# EAGLE design KarateLight (EAGLE 6.3)

## Sheet 1 of 2
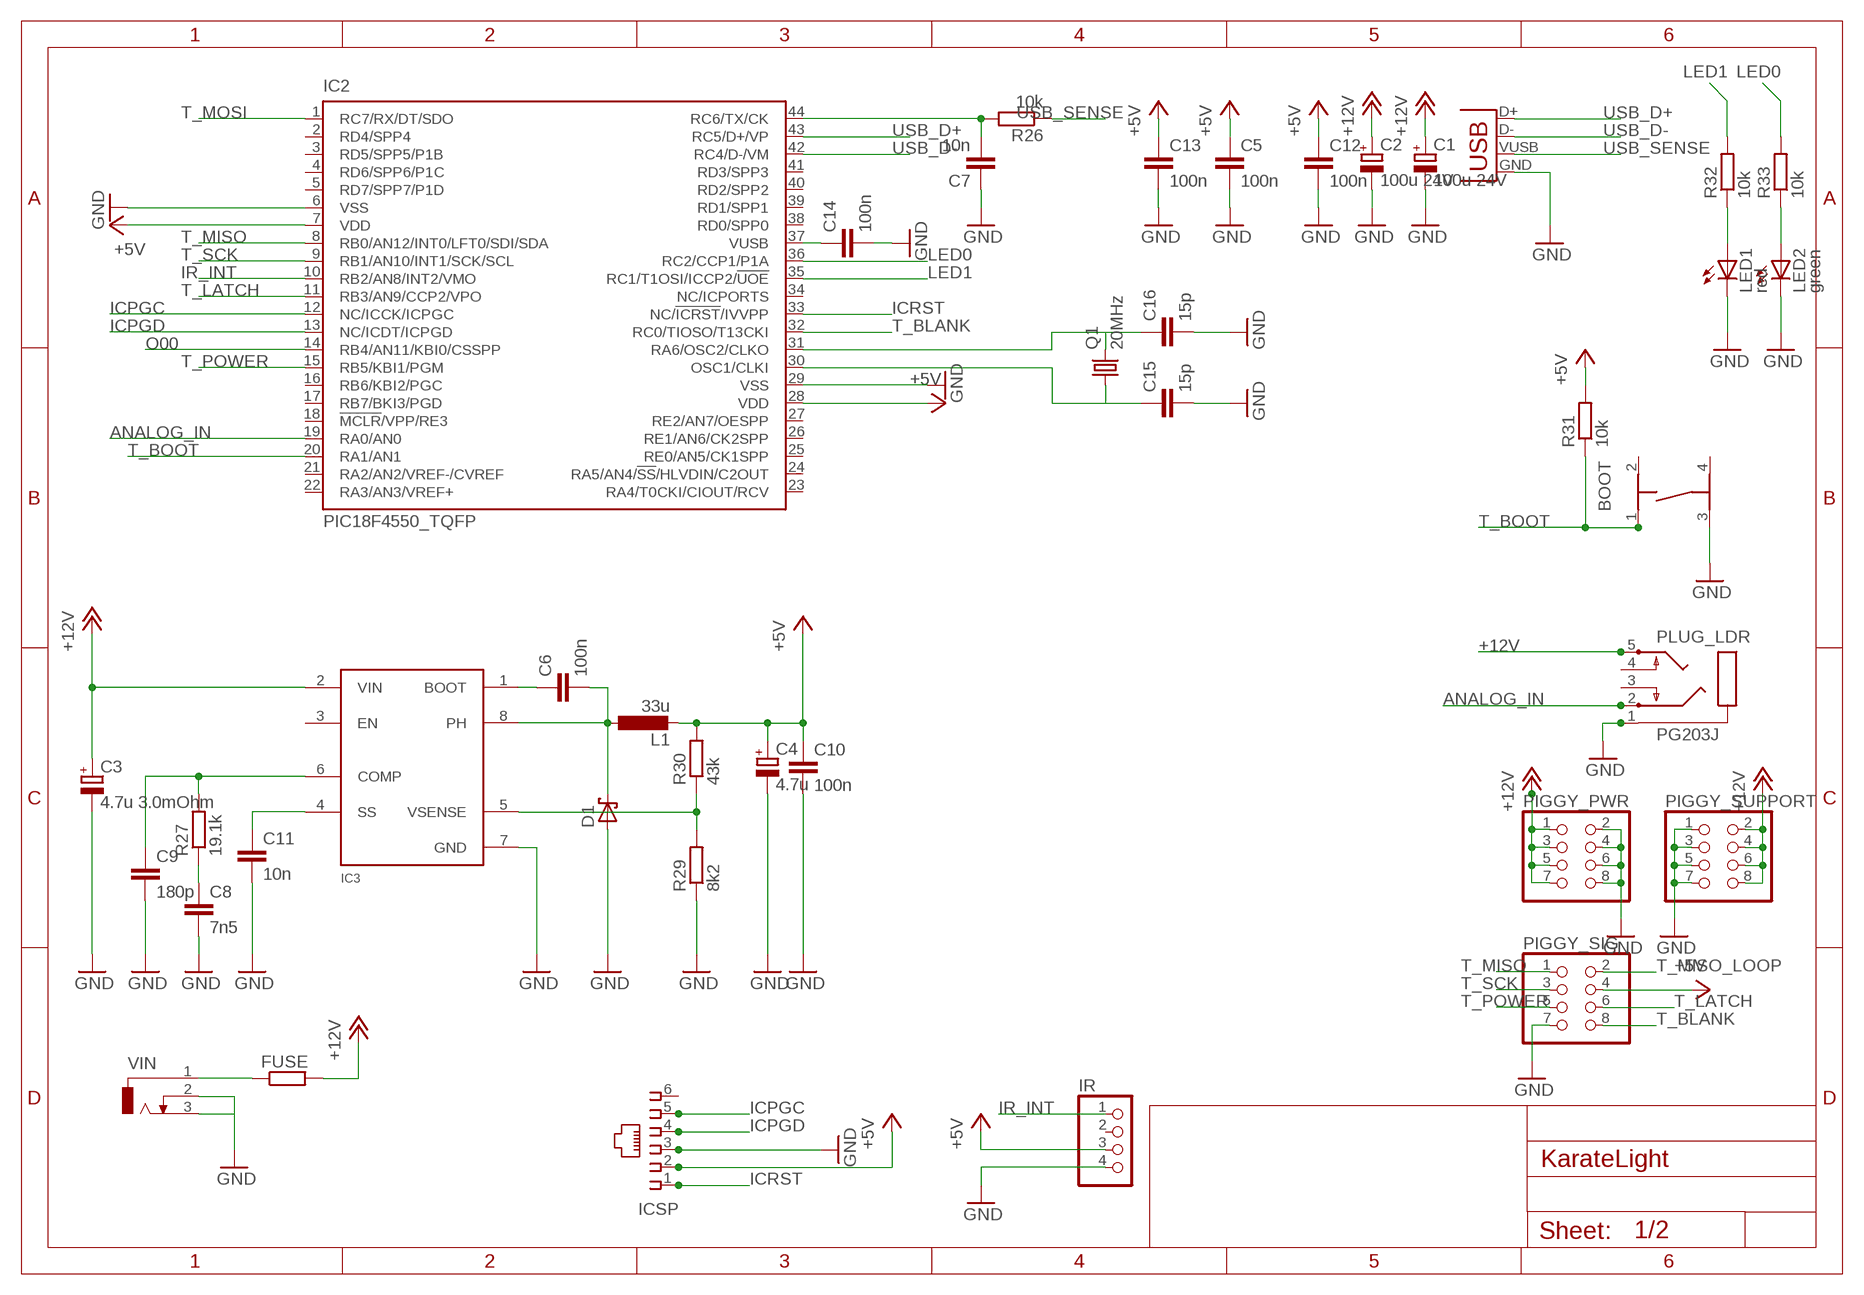
[diagram p0: schematic, sheet 1]

### Parts
BOOT  TASTER-9314_SMD  [TASTER-9314_SMD]
C1  100u 24V  CPOL-EU153CLV-0605  [153CLV-0605]
C2  100u 24V  CPOL-EU153CLV-0605  [153CLV-0605]
C3  4.7u 3.0mOhm  CPOL-EU153CLV-0405  [153CLV-0405]
C4  4.7u  CPOL-EU153CLV-0405  [153CLV-0405]
C5  100n  C-EUC0805K  [C0805K]
C6  100n  C-EUC0603  [C0603]
C7  10n  C-EUC0603  [C0603]
C8  7n5  C-EUC0603  [C0603]
C9  180p  C-EUC0603  [C0603]
C10  100n  C-EUC0603  [C0603]
C11  10n  C-EUC0603  [C0603]
C12  100n  C-EUC0603  [C0603]
C13  100n  C-EUC0805K  [C0805K]
C14  100n  C-EUC0805K  [C0805K]
C15  15p  C-EUC0603  [C0603]
C16  15p  C-EUC0603  [C0603]
D1  SCHOTTKY-DIODESMD  [SMB]
FUSE  R-EU_R4527  [R4527]
IC2  PIC18F4550_TQFP  [TQFP44]
IC3  TPS54232  [SO-08]
ICSP  520250-3  [520250-3]
IR  PINHD-1X4  [1X04]
L1  33u  L-EUPIS2816  [PIS2816]
LED1  red  LEDCHIP-LED0805  [CHIP-LED0805]
LED2  green  LEDCHIP-LED0805  [CHIP-LED0805]
PIGGY_PWR  PINHD-2X4  [2X04]
PIGGY_SIG  PINHD-2X4  [2X04]
PIGGY_SUPPORT  PINHD-2X4  [2X04]
PLUG_LDR  PG203J  [PG203J]
PLUG_USB  USB-B-S  [USB-B-SMT]
Q1  20MHz  CRYSTALHC49UP  [HC49UP]
R26  10k  R-EU_R0603  [R0603]
R27  19.1k  R-EU_R0603  [R0603]
R29  8k2  R-EU_R0603  [R0603]
R30  43k  R-EU_R0603  [R0603]
R31  10k  R-EU_R0603  [R0603]
R32  10k  R-EU_R0603  [R0603]
R33  10k  R-EU_R0603  [R0603]
VIN  DCJ0303  [DCJ0303]

### Nets
+5V: C4.+ C5.1 C10.1 C12.1 C13.1 IC2.7(VDD) IC2.28(VDD) ICSP.2 IR.3 L1.2 PIGGY_SIG.4 R30.2 R31.2 ; also sheet 2
+12V: C1.+ C2.+ C3.+ FUSE.2 IC3.2(VIN) PIGGY_PWR.1 PIGGY_PWR.3 PIGGY_PWR.5 PIGGY_PWR.7 PIGGY_SUPPORT.2 PIGGY_SUPPORT.4 PIGGY_SUPPORT.6 PIGGY_SUPPORT.8 PLUG_LDR.5 ; also sheet 2
ANALOG_IN: IC2.19(RA0/AN0) PLUG_LDR.2
BOOST: C6.2 D1.C IC3.8(PH) L1.1
GND: BOOT.3 C1.- C2.- C3.- C4.- C5.2 C7.1 C8.2 C9.2 C10.2 C11.2 C12.2 C13.2 C14.2 C15.2 C16.2 D1.A IC2.6(VSS) IC2.29(VSS) IC3.7(GND) ICSP.3 IR.4 LED1.C LED2.C PIGGY_PWR.2 PIGGY_PWR.4 PIGGY_PWR.6 PIGGY_PWR.8 PIGGY_SIG.7 PIGGY_SUPPORT.1 PIGGY_SUPPORT.3 PIGGY_SUPPORT.5 PIGGY_SUPPORT.7 PLUG_LDR.1 PLUG_USB.GND R29.1 VIN.2 VIN.3 ; also sheet 2
ICPGC: IC2.12(NC/ICCK/ICPGC) ICSP.5
ICPGD: IC2.13(NC/ICDT/ICPGD) ICSP.4
ICRST: IC2.33(NC/!ICRST!/IVVPP) ICSP.1
IR_INT: IC2.10(RB2/AN8/INT2/VMO) IR.1
LED0: IC2.36(RC2/CCP1/P1A) R33.2
LED1: IC2.35(RC1/T1OSI/ICCP2/!UOE) R32.2
N$2: C14.1 IC2.37(VUSB)
N$3: C15.1 IC2.30(OSC1/CLKI) Q1.1
N$4: C16.1 IC2.31(RA6/OSC2/CLKO) Q1.2
N$5: C8.1 R27.1
N$9: C7.2 IC2.44(RC6/TX/CK) R26.2
N$10: LED1.A R32.1
N$14: C9.1 IC3.6(COMP) R27.2
N$18: LED2.A R33.1
N$37: C11.1 IC3.4(SS)
N$38: IC3.5(VSENSE) R29.2 R30.1
N$39: C6.1 IC3.1(BOOT)
O00: IC2.14(RB4/AN11/KBI0/CSSPP) ; also sheet 2
T_BLANK: IC2.32(RC0/TIOSO/T13CKI) PIGGY_SIG.8 ; also sheet 2
T_BOOT: BOOT.1 IC2.20(RA1/AN1) R31.1
T_LATCH: IC2.11(RB3/AN9/CCP2/VPO) PIGGY_SIG.6 ; also sheet 2
T_MISO: IC2.8(RB0/AN12/INT0/LFT0/SDI/SDA) PIGGY_SIG.1
T_MISO_LOOP: PIGGY_SIG.2 ; also sheet 2
T_MOSI: IC2.1(RC7/RX/DT/SDO) ; also sheet 2
T_POWER: IC2.15(RB5/KBI1/PGM) PIGGY_SIG.5 ; also sheet 2
T_SCK: IC2.9(RB1/AN10/INT1/SCK/SCL) PIGGY_SIG.3 ; also sheet 2
USB_D+: IC2.43(RC5/D+/VP) PLUG_USB.D+
USB_D-: IC2.42(RC4/D-/VM) PLUG_USB.D-
USB_SENSE: PLUG_USB.VUSB(VBUS) R26.1
VIN: FUSE.1 VIN.1
Unconnected: BOOT.2 BOOT.4 IC2.2(RD4/SPP4) IC2.3(RD5/SPP5/P1B) IC2.4(RD6/SPP6/P1C) IC2.5(RD7/SPP7/P1D) IC2.16(RB6/KBI2/PGC) IC2.17(RB7/BKI3/PGD) IC2.18(!MCLR!/VPP/RE3) IC2.21(RA2/AN2/VREF-/CVREF) IC2.22(RA3/AN3/VREF+) IC2.23(RA4/T0CKI/CIOUT/RCV) IC2.24(RA5/AN4/!SS!/HLVDIN/C2OUT) IC2.25(RE0/AN5/CK1SPP) IC2.26(RE1/AN6/CK2SPP) IC2.27(RE2/AN7/OESPP) IC2.34(NC/ICPORTS) IC2.38(RD0/SPP0) IC2.39(RD1/SPP1) IC2.40(RD2/SPP2) IC2.41(RD3/SPP3) IC3.3(EN) ICSP.6 IR.2 PLUG_LDR.3 PLUG_LDR.4

## Sheet 2 of 2
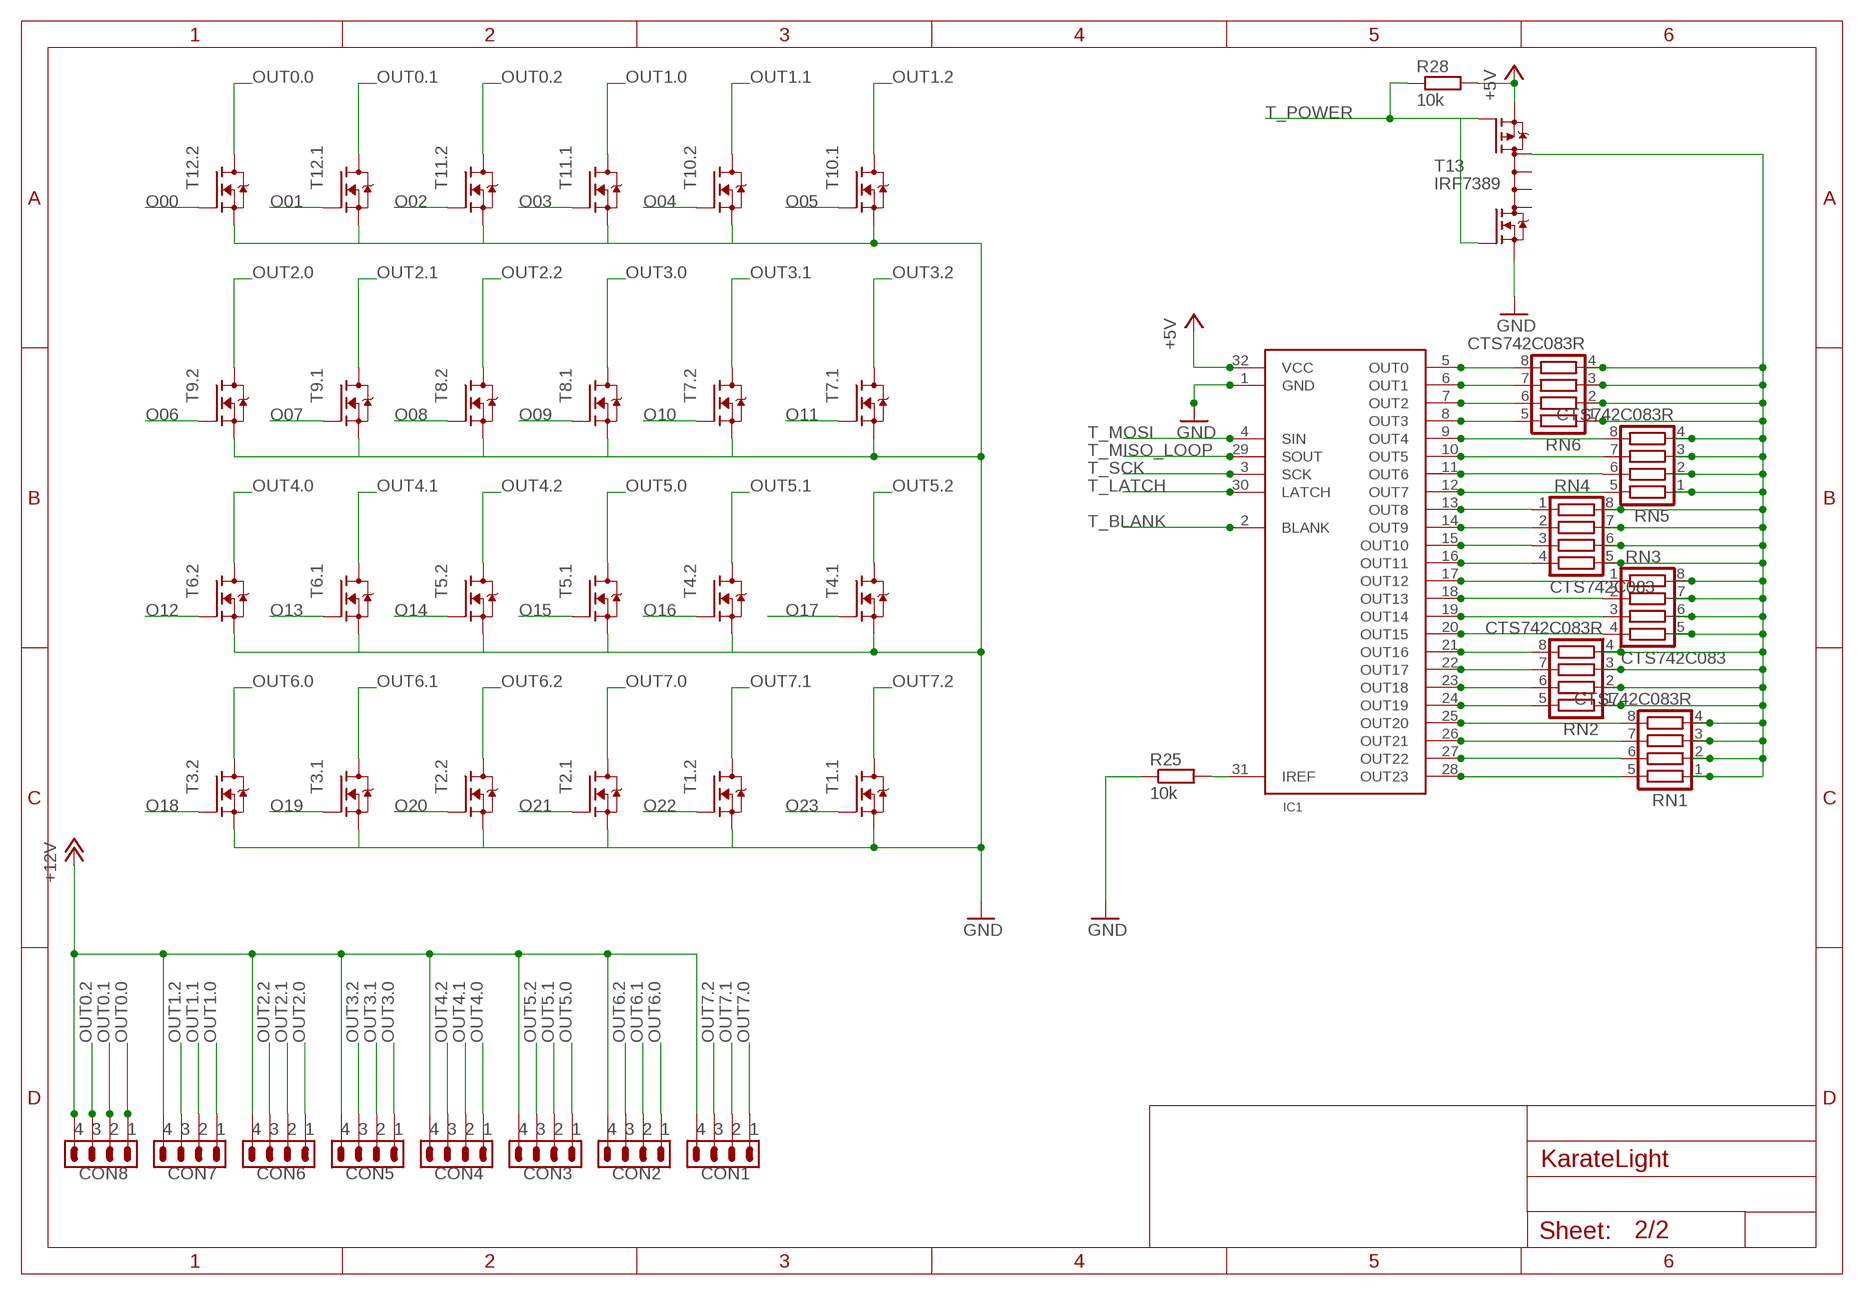
[diagram p1: schematic, sheet 2]

### Parts
CON1  PINHEAD_4W  [MA04-1]
CON2  PINHEAD_4W  [MA04-1]
CON3  PINHEAD_4W  [MA04-1]
CON4  PINHEAD_4W  [MA04-1]
CON5  PINHEAD_4W  [MA04-1]
CON6  PINHEAD_4W  [MA04-1]
CON7  PINHEAD_4W  [MA04-1]
CON8  PINHEAD_4W  [MA04-1]
IC1  TLC5947  [TSSOP32]
R25  10k  R-EU_R0603  [R0603]
R28  10k  R-EU_R0603  [R0603]
RN1  CTS742C083R  [CTS742C083]
RN2  CTS742C083R  [CTS742C083]
RN3  CTS742C083  [CTS742C083]
RN4  CTS742C083  [CTS742C083]
RN5  CTS742C083R  [CTS742C083]
RN6  CTS742C083R  [CTS742C083]
T1  IRF7103  [SO08-IRF]
T2  IRF7103  [SO08-IRF]
T3  IRF7103  [SO08-IRF]
T4  IRF7103  [SO08-IRF]
T5  IRF7103  [SO08-IRF]
T6  IRF7103  [SO08-IRF]
T7  IRF7103  [SO08-IRF]
T8  IRF7103  [SO08-IRF]
T9  IRF7103  [SO08-IRF]
T10  IRF7103  [SO08-IRF]
T11  IRF7103  [SO08-IRF]
T12  IRF7103  [SO08-IRF]
T13  IRF7389  [SO08-IRF]

### Nets
+5V: IC1.32(VCC) R28.2 T13.3(P-S) ; also sheet 1
+12V: CON1.4 CON2.4 CON3.4 CON4.4 CON5.4 CON6.4 CON7.4 CON8.4 ; also sheet 1
FET-ONOFF: RN1.1 RN1.2 RN1.3 RN1.4 RN2.1 RN2.2 RN2.3 RN2.4 RN3.5 RN3.6 RN3.7 RN3.8 RN4.5 RN4.6 RN4.7 RN4.8 RN5.1 RN5.2 RN5.3 RN5.4 RN6.1 RN6.2 RN6.3 RN6.4 T13.5(D)
GND: IC1.1(GND) R25.1 T1.1(.1:S) T1.3(.2:S) T2.1(.1:S) T2.3(.2:S) T3.1(.1:S) T3.3(.2:S) T4.1(.1:S) T4.3(.2:S) T5.1(.1:S) T5.3(.2:S) T6.1(.1:S) T6.3(.2:S) T7.1(.1:S) T7.3(.2:S) T8.1(.1:S) T8.3(.2:S) T9.1(.1:S) T9.3(.2:S) T10.1(.1:S) T10.3(.2:S) T11.1(.1:S) T11.3(.2:S) T12.1(.1:S) T12.3(.2:S) T13.1(N-S) ; also sheet 1
N$1: IC1.31(IREF) R25.2
O00: IC1.5(OUT0) RN6.8 T12.4(.2:G) ; also sheet 1
O01: IC1.6(OUT1) RN6.7 T12.2(.1:G)
O02: IC1.7(OUT2) RN6.6 T11.4(.2:G)
O03: IC1.8(OUT3) RN6.5 T11.2(.1:G)
O04: IC1.9(OUT4) RN5.8 T10.4(.2:G)
O05: IC1.10(OUT5) RN5.7 T10.2(.1:G)
O06: IC1.11(OUT6) RN5.6 T9.4(.2:G)
O07: IC1.12(OUT7) RN5.5 T9.2(.1:G)
O08: IC1.13(OUT8) RN4.1 T8.4(.2:G)
O09: IC1.14(OUT9) RN4.2 T8.2(.1:G)
O10: IC1.15(OUT10) RN4.3 T7.4(.2:G)
O11: IC1.16(OUT11) RN4.4 T7.2(.1:G)
O12: IC1.17(OUT12) RN3.1 T6.4(.2:G)
O13: IC1.18(OUT13) RN3.2 T6.2(.1:G)
O14: IC1.19(OUT14) RN3.3 T5.4(.2:G)
O15: IC1.20(OUT15) RN3.4 T5.2(.1:G)
O16: IC1.21(OUT16) RN2.8 T4.4(.2:G)
O17: IC1.22(OUT17) RN2.7 T4.2(.1:G)
O18: IC1.23(OUT18) RN2.6 T3.4(.2:G)
O19: IC1.24(OUT19) RN2.5 T3.2(.1:G)
O20: IC1.25(OUT20) RN1.8 T2.4(.2:G)
O21: IC1.26(OUT21) RN1.7 T2.2(.1:G)
O22: IC1.27(OUT22) RN1.6 T1.4(.2:G)
O23: IC1.28(OUT23) RN1.5 T1.2(.1:G)
OUT0.0: CON8.1 T12.6(.2:D)
OUT0.1: CON8.2 T12.8(.1:D)
OUT0.2: CON8.3 T11.6(.2:D)
OUT1.0: CON7.1 T11.8(.1:D)
OUT1.1: CON7.2 T10.6(.2:D)
OUT1.2: CON7.3 T10.8(.1:D)
OUT2.0: CON6.1 T9.6(.2:D)
OUT2.1: CON6.2 T9.8(.1:D)
OUT2.2: CON6.3 T8.6(.2:D)
OUT3.0: CON5.1 T8.8(.1:D)
OUT3.1: CON5.2 T7.6(.2:D)
OUT3.2: CON5.3 T7.8(.1:D)
OUT4.0: CON4.1 T6.6(.2:D)
OUT4.1: CON4.2 T6.8(.1:D)
OUT4.2: CON4.3 T5.6(.2:D)
OUT5.0: CON3.1 T5.8(.1:D)
OUT5.1: CON3.2 T4.6(.2:D)
OUT5.2: CON3.3 T4.8(.1:D)
OUT6.0: CON2.1 T3.6(.2:D)
OUT6.1: CON2.2 T3.8(.1:D)
OUT6.2: CON2.3 T2.6(.2:D)
OUT7.0: CON1.1 T2.8(.1:D)
OUT7.1: CON1.2 T1.6(.2:D)
OUT7.2: CON1.3 T1.8(.1:D)
T_BLANK: IC1.2(BLANK) ; also sheet 1
T_LATCH: IC1.30(LATCH) ; also sheet 1
T_MISO_LOOP: IC1.29(SOUT) ; also sheet 1
T_MOSI: IC1.4(SIN) ; also sheet 1
T_POWER: R28.1 T13.2(N-G) T13.4(P-G) ; also sheet 1
T_SCK: IC1.3(SCK) ; also sheet 1
Unconnected: T13.6(D) T13.7(D) T13.8(D)

## Library data of the parts
BOOT = Ergaenzung:TASTER-9314_SMD
C1-C4 = rcl:CPOL-EU: POLARIZED CAPACITOR, European symbol
C5-C16 = rcl:C-EU: CAPACITOR, European symbol
CON1-CON8 = pinheader:PINHEAD_4W
D1 = diode:SCHOTTKY-DIODE: Schottky Diode
FUSE R25-R33 = rcl:R-EU_: RESISTOR, European symbol
IC1 = TLC5947:TLC5947: 24CH PWM LED Driver
IC2 = microchip:PIC18F4*_TQFP: USB Microcontrollers with nanoWatt Technology High-Performance, Enhanced Flash, 28/40/44-Pin, Source: http://ww1.microchip.com/downloads/en/devicedoc/39632c.pdf
IC3 = tps54232:TPS54232: TPS54232 2-A, 28-V, 1-MHz, Step-Down DC-DC Converter With Eco-Mode
ICSP = con-amp:520250-3: AMP connector
IR = pinhead:PINHD-1X4: PIN HEADER
L1 = rcl:L-EU: INDUCTOR, European symbol
LED1 LED2 = led:LED: LED OSRAM: - CHIPLED LG R971, LG N971, LY N971, LG Q971, LY Q971, LO R971, LY R971 LH N974, LH R974 LS Q976, LO Q976, LY Q976 LO Q996 - Hyper CHIPLED LW Q18S LB Q993, LB Q99A, LB R99A - SideLED LS A670, LO A670, LY A670, LG A670, LP A670 LB A673, LV A673, LT A673, LW A673 LH A674 LY A675 LS A676, LA A676, LO A676, LY A676, LW A676 LS A679, LY A679, LG A679 - Hyper Micro SIDELED® LS Y876, LA Y876, LO Y876, LY Y876 LT Y87S - SmartLED LW L88C, LW L88S LB L89C, LB L89S, LG L890 LS L89K, LO L89K, LY L89K LS L896, LA L896, LO L896, LY L896 - TOPLED LS T670, LO T670, LY T670, LG T670, LP T670 LSG T670, LSP T670, LSY T670, LOP T670, LYG T670 LG T671, LOG T671, LSG T671 LB T673, LV T673, LT T673, LW T673 LH T674 LS T676, LA T676, LO T676, LY T676, LB T676, LH T676, LSB T676, LW T676 LB T67C, LV T67C, LT T67C, LS T67K, LO T67K, LY T67K, LW E67C LS E67B, LA E67B, LO E67B, LY E67B, LB E67C, LV E67C, LT E67C LW T67C LS T679, LY T679, LG T679 LS T770, LO T770, LY T770, LG T770, LP T770 LB T773, LV T773, LT T773, LW T773 LH T774 LS E675, LA E675, LY E675, LS T675 LS T776, LA T776, LO T776, LY T776, LB T776 LHGB T686 LT T68C, LB T68C - Hyper Mini TOPLED® LB M676 - Mini TOPLED Santana® LG M470 LS M47K, LO M47K, LY M47K Source: http://www.osram.convergy.de LUXEON: - LUMILED® LXK2-PW12-R00, LXK2-PW12-S00, LXK2-PW14-U00, LXK2-PW14-V00 LXK2-PM12-R00, LXK2-PM12-S00, LXK2-PM14-U00 LXK2-PE12-Q00, LXK2-PE12-R00, LXK2-PE12-S00, LXK2-PE14-T00, LXK2-PE14-U00 LXK2-PB12-K00, LXK2-PB12-L00, LXK2-PB12-M00, LXK2-PB14-N00, LXK2-PB14-P00, LXK2-PB14-Q00 LXK2-PR12-L00, LXK2-PR12-M00, LXK2-PR14-Q00, LXK2-PR14-R00 LXK2-PD12-Q00, LXK2-PD12-R00, LXK2-PD12-S00 LXK2-PH12-R00, LXK2-PH12-S00 LXK2-PL12-P00, LXK2-PL12-Q00, LXK2-PL12-R00 Source: www.luxeon.com KINGBRIGHT: KA-3528ASYC Source: www.kingbright.com
PIGGY_PWR PIGGY_SIG PIGGY_SUPPORT = pinhead:PINHD-2X4: PIN HEADER
PLUG_LDR = 3.5mm_klinke:PG203J: MIC/HEADPHONE JACK KS-S stereo microphone/headphone jack PG203JN (Schukat); OC_FARNELL: unknown; OC_NEWARK: unknown
PLUG_USB = con-usb:USB: USB Connectors
Q1 = crystal:CRYSTAL: CRYSTAL
RN1 RN2 RN5 RN6 = res-network:CTS742C083: Chip Resistor Array 4 Single Resistor Source: http://www.ctscorp.com/components/Datasheets/CTSChipArrayDs.pdf
RN3 RN4 = res-network:CTS742C083: Chip Resistor Array 4 Single Resistor Source: http://www.ctscorp.com/components/Datasheets/CTSChipArrayDs.pdf; OC_FARNELL: unknown; OC_NEWARK: unknown
T1-T12 = IRF7103:IRF7103: Dual HexFET Power Mosfet http://www.irf.com/product-info/datasheets/data/irf7103.pdf
T13 = transistor-fet:IRF7389: Complimentary Half Bridge HEXFET Power MOSFET Source: http://www.irf.com/product-info/datasheets/data/irf7389.pdf
VIN = con-jack:DCJ0303: DC POWER JACK Source: DCJ0303.pdf

## Board
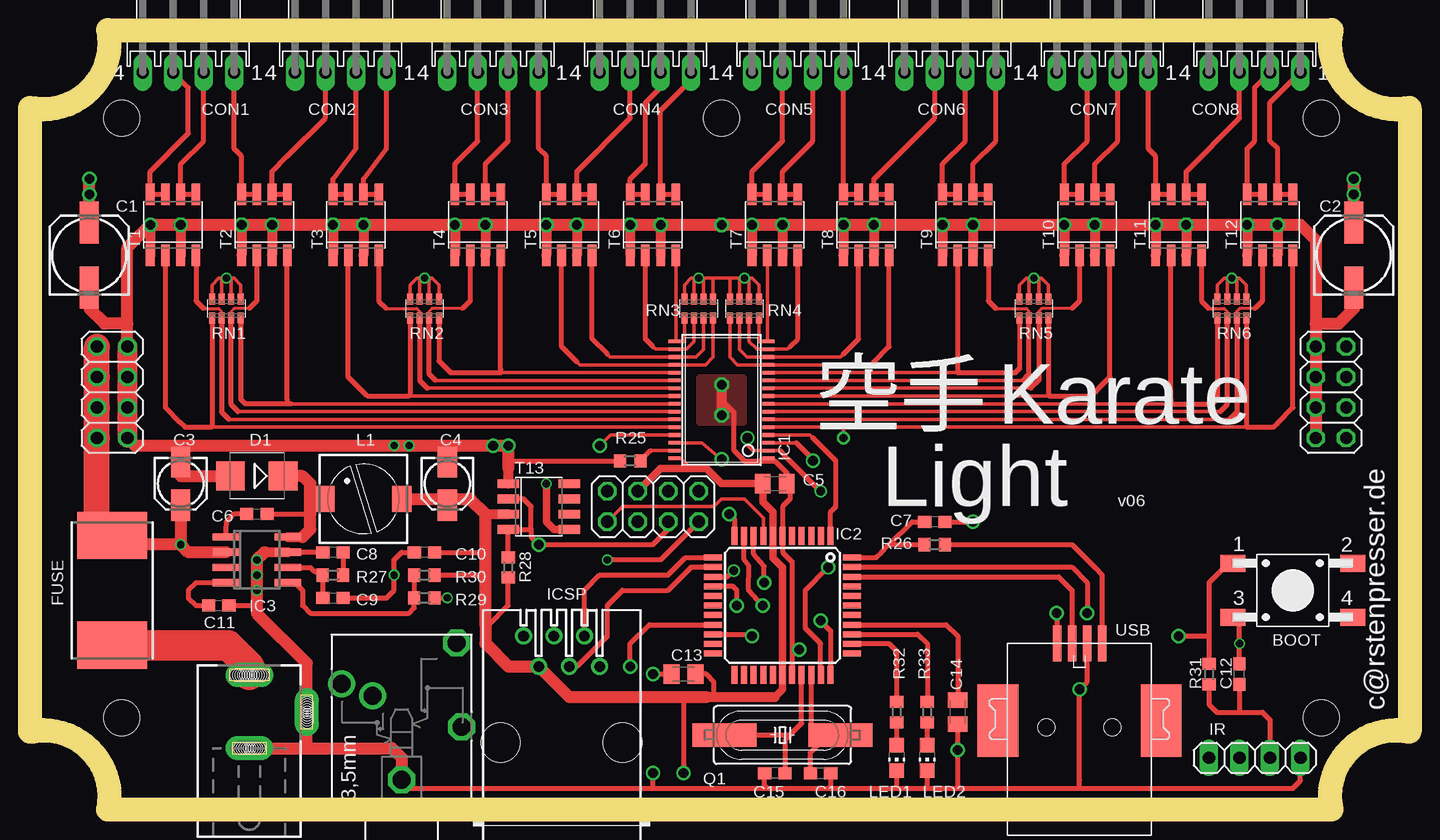
[diagram p2: board, top side]
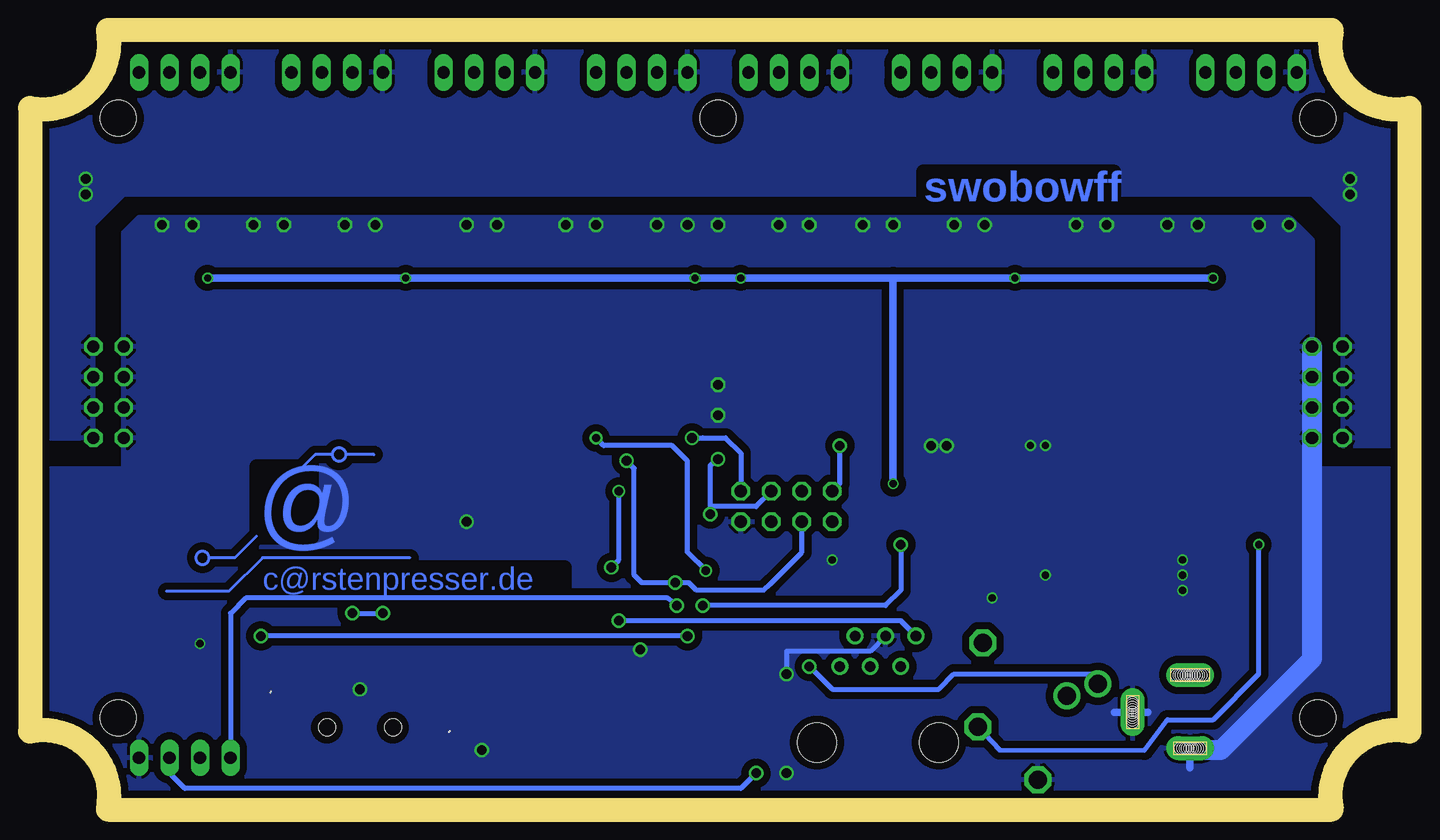
[diagram p3: board, bottom side, seen from below]

Size 115 x 65 mm. Coordinates in mm from the lower left corner, seen from the top.
Outline: 0,6.5 arc-113 6.5,0 108.5,0 arc-113 115,6.5 115,58.5 arc-113 108.5,65 6.5,65 arc-113 0,58.5 0,6.5
Copper layers (1*16): Top 0.035mm / dielectric 1.5mm / Bottom 0.035mm
Design rules "EagleRules": minimum track width 7mil, minimum drill 12mil, track to track 7mil, track to pad 7mil, pad to pad 7mil, via to via 7mil, smd to smd 0mil, copper to edge 20mil, drill to drill 10mil, minimum pad ring 10mil, minimum via ring 6mil, stop-mask expansion 2mil, vias tented up to drill 25mil, thermal gap 10mil
Holes 3 mm at 57.65,57.65 7.65,57.65 7.65,7.65 107.65,7.65 107.65,57.65
Holes 1 mm at 18.4,11.2 18.6,11.2 18.8,11.2 19,11.2 19.2,11.2 19.4,11.2 18.2,11.2 18,11.2 17.8,11.2 17.6,11.2 17.4,11.2 17.2,11.2 18.5,5.1 18.7,5.1 18.9,5.1 19.1,5.1 18.3,5.1 18.1,5.1 17.9,5.1 17.7,5.1 17.5,5.1 23.1,8.3 23.1,8.5 23.1,8.7 23.1,8.9 23.1,8.1 23.1,7.9 23.1,7.7 23.1,7.5 23.1,7.3

### Footprints (pad centres in the part's own frame; a part is rotated, then mirrored left to right if it is on the bottom)
TASTER-9314_SMD = smd 2.1 x 1.4: 1 -5,2.25; 2 5,2.25; 3 -5,-2.25; 4 5,-2.25
153CLV-0605 = smd 3.5 x 1.6: + 2.7,0; - -2.7,0
153CLV-0405 = smd 2.6 x 1.6: + 1.8,0; - -1.8,0
C0805K = smd 1.3 x 1.6: 1 -1,0; 2 1,0
C0603 = smd 1.1 x 1: 1 -0.85,0; 2 0.85,0
MA04-1 = drill 1.016 long: 1 -3.81,0; 2 -1.27,0; 3 1.27,0; 4 3.81,0
SMB = smd 2.4 x 2.4: A 2.2,0; C -2.2,0
R4527 = smd 3.94 x 5.84: 1 -4.575,0; 2 4.575,0
TSSOP32 = smd 0.305 x 0.991: 1 -4.875,-3.918; 2 -4.225,-3.918; 3 -3.575,-3.918; 4 -2.925,-3.918; 5 -2.275,-3.918; 6 -1.625,-3.918; 7 -0.975,-3.918; 8 -0.325,-3.918; 9 0.325,-3.918; 10 0.975,-3.918; 11 1.625,-3.918; 12 2.275,-3.918; 13 2.925,-3.918; 14 3.575,-3.918; 15 4.225,-3.918; 16 4.875,-3.918; 17 4.875,3.918; 18 4.225,3.918; 19 3.575,3.918; 20 2.925,3.918; 21 2.275,3.918; 22 1.625,3.918; 23 0.975,3.918; 24 0.325,3.918; 25 -0.325,3.918; 26 -0.975,3.918; 27 -1.625,3.918; 28 -2.275,3.918; 29 -2.925,3.918; 30 -3.575,3.918; 31 -4.225,3.918; 32 -4.875,3.918
TQFP44 = smd 1.5 x 0.5: 1 -5.8,4; 2 -5.8,3.2; 3 -5.8,2.4; 4 -5.8,1.6; 5 -5.8,0.8; 6 -5.8,0; 7 -5.8,-0.8; 8 -5.8,-1.6; 9 -5.8,-2.4; 10 -5.8,-3.2; 11 -5.8,-4; 23 5.8,-4; 24 5.8,-3.2; 25 5.8,-2.4; 26 5.8,-1.6; 27 5.8,-0.8; 28 5.8,0; 29 5.8,0.8; 30 5.8,1.6; 31 5.8,2.4; 32 5.8,3.2; 33 5.8,4 | smd 0.5 x 1.5: 12 -4,-5.8; 13 -3.2,-5.8; 14 -2.4,-5.8; 15 -1.6,-5.8; 16 -0.8,-5.8; 17 0,-5.8; 18 0.8,-5.8; 19 1.6,-5.8; 20 2.4,-5.8; 21 3.2,-5.8; 22 4,-5.8; 34 4,5.8; 35 3.2,5.8; 36 2.4,5.8; 37 1.6,5.8; 38 0.8,5.8; 39 0,5.8; 40 -0.8,5.8; 41 -1.6,5.8; 42 -2.4,5.8; 43 -3.2,5.8; 44 -4,5.8
SO-08 = smd 0.6 x 2.2: 1 -1.905,-2.6; 2 -0.635,-2.6; 3 0.635,-2.6; 4 1.905,-2.6; 5 1.905,2.6; 6 0.635,2.6; 7 -0.635,2.6; 8 -1.905,2.6
520250-3 = drill 0.889: 1 -3.175,8.89; 2 -1.905,6.35; 3 -0.635,8.89; 4 0.635,6.35; 5 1.905,8.89; 6 3.175,6.35 | hole 3.251: -5.08,0; 5.08,0
1X04 = drill 1.016 long: 1 -3.81,0; 2 -1.27,0; 3 1.27,0; 4 3.81,0
PIS2816 = smd 2.2 x 1.6: 1 0,3.2; 2 0,-3.2
CHIP-LED0805 = smd 1.2 x 1.2: A 0,-1.05; C 0,1.05
2X04 = drill 1.016 octagon: 1 -3.81,-1.27; 2 -3.81,1.27; 3 -1.27,-1.27; 4 -1.27,1.27; 5 1.27,-1.27; 6 1.27,1.27; 7 3.81,-1.27; 8 3.81,1.27
PG203J = drill 1.5 octagon: 1 -5.004,0; 5 -0.606,-5 | drill 1.5: 2 2.996,5; 3 1.996,2.4 | drill 1.499 octagon: 4 6.396,-4.6
USB-B-SMT = smd 6.04 x 3.4: 5 0.58,6.8; 6 0.58,-6.8 | smd 3 x 0.7: D+ 7,1.875; D- 7,0.625; GND 7,-0.625; VUSB 7,-1.875 | hole 1.4: 0,2.75; 0,-2.75
HC49UP = smd 5.334 x 1.93: 1 -4.826,0; 2 4.826,0
R0603 = smd 1 x 1.1: 1 -0.85,0; 2 0.85,0
CTS742C083 = smd 0.5 x 0.9: 1 -1.2,-0.8; 2 -0.4,-0.8; 3 0.4,-0.8; 4 1.2,-0.8; 5 1.2,0.8; 6 0.4,0.8; 7 -0.4,0.8; 8 -1.2,0.8
SO08-IRF = smd 0.72 x 1.78: 1 -1.905,-2.543; 2 -0.635,-2.543; 3 0.635,-2.543; 4 1.905,-2.543; 5 1.905,2.543; 6 0.635,2.543; 7 -0.635,2.543; 8 -1.905,2.543
DCJ0303 = drill 1 pad 2 long: 1 0,3.1; 2 4.8,0; 3 0,-3

### Placement (x,y rotation side)
BOOT  105.28,18.28 0 top
C1  4.95,46.22 90 top
C2  110.36,46.22 90 top
C3  12.56,27.17 270 top
C4  34.79,27.17 270 top
C5  62.09,27.17 0 top
C6  18.91,24.63 0 top
C7  75.43,24 180 top
C8  25.27,21.45 180 top
C9  25.27,17.64 0 top
C10  32.88,21.45 180 top
C11  15.74,17.01 0 top
C12  100.83,11.29 90 top
C13  54.48,11.29 180 top
C14  77.33,8.12 270 top
C15  62.09,3.04 180 top
C16  65.91,3.04 0 top
CON1  13.2,61.46 180 top
CON2  25.9,61.46 180 top
CON3  38.6,61.46 180 top
CON4  51.3,61.46 180 top
CON5  64,61.46 180 top
CON6  76.7,61.46 180 top
CON7  89.4,61.46 180 top
CON8  102.1,61.46 180 top
D1  18.91,27.8 180 top
FUSE  6.85,18.28 90 top
IC1  57.65,34.16 90 top
IC2  62.73,17.01 270 top
IC3  18.91,20.82 270 top
ICSP  44.31,5.58 0 top
IR  102.1,4.31 0 top
L1  27.8,25.9 90 top
LED1  72.25,4.31 180 top
LED2  74.8,4.31 180 top
PIGGY_PWR  6.85,34.79 270 top
PIGGY_SIG  51.94,25.27 0 top
PIGGY_SUPPORT  108.45,34.79 270 top
PLUG_LDR  30.98,7.49 90 top
PLUG_USB  87.5,6.85 90 top
Q1  62.73,6.21 0 top
R25  50.03,29.07 0 top
R26  75.43,22.09 180 top
R27  25.27,19.55 180 top
R28  39.87,20.18 270 top
R29  32.88,17.64 180 top
R30  32.88,19.55 0 top
R31  98.29,11.29 270 top
R32  72.25,8.12 90 top
R33  74.8,8.12 90 top
RN1  16.38,41.77 180 top
RN2  32.88,41.77 180 top
RN3  55.74,41.77 0 top
RN4  59.55,41.77 0 top
RN5  83.69,41.77 180 top
RN6  100.19,41.77 180 top
T1  11.93,48.76 0 top
T2  19.55,48.76 0 top
T3  27.17,48.76 0 top
T4  37.33,48.76 0 top
T5  44.95,48.76 0 top
T6  51.94,48.76 0 top
T7  62.09,48.76 0 top
T8  69.72,48.76 0 top
T9  77.97,48.76 0 top
T10  88.13,48.76 0 top
T11  95.75,48.76 0 top
T12  103.37,48.76 0 top
T13  42.41,25.27 270 top
VIN  18.28,8.12 0 top

### Tracks (layer width: path | path; a pad name or v marks a point on that pad's centre or on a via)
+5V  (via drill 0.8)
  Top 0.305: IC1.32 54.27,29.28 55.11,28.44
  Top 0.406: R28.2 39.87,17.01 38.22,15.36 37.97,15.36 | C13.1 56.38,11.29 57.02,10.66 57.02,9.39 | 54.48,9.39 v54.48,3.04 | C10.1 37.97,21.45 | R31.2 98.29,8.76 98.92,8.12 100.83,8.12 | 100.83,8.12 102.73,8.12 103.37,7.49 IR.3 | C12.1 100.83,8.12 | R30.2 37.97,19.55
  Top 0.61: 62.09,9.39 62.73,10.03 IC2.28 62.73,20.18 61.93,20.98 IC2.7 61.93,24.8 61.09,25.63 C5.1 57.65,27.17 56.38,28.44 55.11,28.44 52.57,28.44 PIGGY_SIG.4
  Top 0.813: 37.97,24.63 T13.3 | 62.09,9.39 57.02,9.39 56.38,9.39
  Top 1.016: 56.38,9.39 54.48,9.39 44.95,9.39 ICSP.2 39.87,11.93 37.97,13.84 37.97,15.36 37.97,19.55 37.97,21.45 37.97,24.63 36.7,25.9 34.79,25.9 C4.+ 34.69,25.9 L1.2
  Bottom 0.406: IR.3 103.37,3.04 102.1,1.77 55.74,1.77 v54.48,3.04
+12V  (via drill 0.6 pad 0.41, 0.8)
  Top 0.406: 8.76,22.09 7.78,21.8
  Top 1.016: C1.+ v4.95,51.3 v4.95,52.57 | v110.36,52.57 v110.36,51.3 C2.+ | IC3.2 13.2,21.45 v12.56,22.09 | v12.56,22.09 8.76,22.09 | C3.+ v12.56,22.09
  Top 1.27: 7.78,21.8 6.85,22.73 FUSE.2
  Top 1.778: FUSE.2 5.58,23.36
  Top 2.184: 5.58,23.36 PIGGY_PWR.7 PIGGY_PWR.5 PIGGY_PWR.3 PIGGY_PWR.1
  Bottom 0.406: PLUG_LDR.5 34.18,4.97 22.09,4.95 20.18,7.49 16.38,7.49 12.56,11.29 v12.56,22.09
  pour Bottom (isolate 0.61): 1.14,30.34 1.14,64 114.17,64 114.17,30.98 109.72,30.98 109.72,48.76 107.18,51.3 8.12,51.3 5.58,48.76 5.58,30.34
ANALOG_IN  (via drill 0.8)
  Top 0.406: IC2.19 51.6,15.41 50.03,13.84 v50.03,11.93
  Bottom 0.406: v50.03,11.93 48.12,10.03 39.23,10.03 37.97,11.29 26.54,11.29 25.9,10.4 PLUG_LDR.2
BOOST
  Top 0.406: 21.2,27.8 D1.C | C6.2 23.36,24.63
  Top 0.813: IC3.8 22.73,22.73
  Top 1.016: 22.73,22.73 23.36,23.36 23.36,24.63 23.36,25.9 | 23.36,25.9 23.36,27.17 22.73,27.8 21.2,27.8 | L1.1 23.36,25.9
FET-ONOFF  (via drill 0.6 pad 0.25)
  Top 0.305: RN1.4 15.18,43.75 15.74,44.31 15.97,44.31 | 16.77,44.31 17.01,44.31 17.57,43.75 RN1.1 | RN1.2 16.77,44.31 | 16.77,44.31 v16.38,44.31 15.97,44.31 | RN1.3 15.97,44.31 | RN2.4 31.68,43.75 32.25,44.31 32.48,44.31 | 32.48,44.31 v32.88,44.31 33.28,44.31 | RN2.1 34.09,43.75 33.52,44.31 33.28,44.31 | RN3.8 54.55,43.75 55.11,44.31 55.34,44.31 | RN4.5 60.76,43.75 60.19,44.31 59.95,44.31 | 59.95,44.31 v59.55,44.31 59.16,44.31 | 59.16,44.31 58.35,44.31 | 58.35,44.31 56.95,44.31 | 56.95,44.31 56.15,44.31 | RN5.4 82.48,43.75 83.05,44.31 83.28,44.31 | RN5.1 84.89,43.75 84.32,44.31 84.08,44.31 | RN6.4 99,43.75 99.56,44.31 99.8,44.31 | RN6.1 101.39,43.75 100.83,44.31 100.59,44.31 | RN6.2 100.59,44.31 | 100.59,44.31 v100.19,44.31 99.8,44.31 | RN6.3 99.8,44.31 | RN5.2 84.08,44.31 | RN5.3 83.28,44.31 | 83.28,44.31 v83.69,44.31 84.08,44.31 | RN4.8 58.35,44.31 | RN4.7 59.16,44.31 | RN4.6 59.95,44.31 | RN3.7 55.34,44.31 | RN3.6 56.15,44.31 | 56.15,44.31 v55.74,44.31 55.34,44.31 | RN3.5 56.95,44.31 | RN2.2 33.28,44.31 | RN2.3 32.48,44.31
  Top 0.61: T13.5 43.68,23.36 43.05,24 v43.05,27.17
  Bottom 0.61: v100.19,44.31 v83.69,44.31 v59.55,44.31 v55.74,44.31 43.05,44.31 | 43.05,44.31 v32.88,44.31 v16.38,44.31 | v43.05,27.17 43.05,44.31
GND  (via drill 0.6 pad 0.25, 0.6 pad 0.41, 0.8, 0.8 pad 0.61, 0.8 pad 0.81)
  Top 0.254: 30.98,4.31 30.34,4.95
  Top 0.305: IC1.1 61.03,29.28 60.83,29.07
  Top 0.406: C15.2 61.24,1.99 61.46,1.77 | 61.46,1.77 66.54,1.77 | C16.2 66.75,1.99 66.54,1.77 | PLUG_USB.GND 88.13,10.66 v87.5,10.03 87.48,10.02 87.5,2.41 87.5,1.77 | 74.8,1.77 77.33,1.77 | 77.33,1.77 87.5,1.77 | 77.33,1.77 v77.33,4.95 C14.2 | 51.94,1.77 30.98,1.77 30.98,2.41 | 51.94,1.77 61.46,1.77 | 66.54,1.77 72.25,1.77 | 72.25,1.77 74.8,1.77 | 72.25,1.77 LED1.C | 74.8,1.77 LED2.C | 63.53,13.33 63.53,20.66 62.73,21.45 IC2.6 62.73,25.27 63.37,25.9 63.37,26.27 C5.2 63.09,28.07 62.09,29.07 60.83,29.07 59.55,29.07 58.65,29.98 58.65,33.16 57.65,34.16 | 63.53,13.33 IC2.29 | v39.87,30.34 39.87,29.07 R25.1 | IR.4 105.91,2.41 105.28,1.77 87.5,1.77 | 63.53,13.33 v64.13,13.33 | 51.94,1.77 v51.94,3.04 | C7.1 v78.61,24 | v51.94,11.29 C13.2 | 16.71,27.7 D1.A | 39.86,28.44 39.87,28.44 | C9.2 29.71,17.64 30.34,18.28 v30.34,19.55 30.34,20.82 30.98,21.45 C10.2 | C11.2 18.91,17.01 | C8.2 IC3.7 | PIGGY_SIG.7 52.57,20.82 v48.12,20.82 | C12.2 v100.83,13.84 100.83,15.95 BOOT.3 | R29.1 v34.79,17.64
  Top 0.813: v104,48.76 T12.3 | v50.03,48.76 T6.1 | v52.57,48.76 T6.3 | v67.81,48.76 T8.1 | v70.35,48.76 T8.3 | v60.19,48.76 T7.1 | v62.73,48.76 T7.3 | v76.06,48.76 T9.1 | v78.61,48.76 T9.3 | v101.47,48.76 T12.1 | v96.39,48.76 T11.3 | v93.84,48.76 T11.1 | v88.77,48.76 T10.3 | v86.22,48.76 T10.1 | v10.03,48.76 T1.1 | v12.56,48.76 T1.3 | v17.64,48.76 T2.1 | v20.18,48.76 T2.3 | v25.27,48.76 T3.1 | v27.8,48.76 T3.3 | v35.42,48.76 T4.1 | v37.97,48.76 T4.3 | v43.05,48.76 T5.1 | v45.59,48.76 T5.3 | v57.65,32.88 v57.65,35.42 57.65,34.16 | PIGGY_PWR.8 8.76,30.34 | 39.87,28.44 T13.1 | IC3.7 19.55,21.45
  Top 1.016: VIN.3 22.9,5.12 | PIGGY_PWR.2 8.12,40.51 | 8.12,40.51 8.12,46.85 v10.03,48.76 v12.56,48.76 v17.64,48.76 v20.18,48.76 v25.27,48.76 v27.8,48.76 v35.42,48.76 v37.97,48.76 v43.05,48.76 v45.59,48.76 v50.03,48.76 v52.57,48.76 v57.65,48.76 v60.19,48.76 v62.73,48.76 v67.81,48.76 v70.35,48.76 v76.06,48.76 v78.61,48.76 v86.22,48.76 v88.77,48.76 v93.84,48.76 v96.39,48.76 v101.47,48.76 v104,48.76 105.91,48.76 107.18,47.49 107.18,40.51 | 8.76,30.34 12.56,30.34 | 12.56,30.34 v30.34,30.34 v31.61,30.34 34.79,30.34 | 34.79,30.34 v38.6,30.34 v39.87,30.34 39.87,28.44 | 107.18,40.51 PIGGY_SUPPORT.7 | C1.- 4.95,41.77 6.21,40.51 8.12,40.51 | C2.- 110.36,41.77 109.08,40.51 107.18,40.51 | 22.9,5.12 23.08,5.3 VIN.2 23.08,12.21 18.91,16.38 18.91,17.01 v18.91,18.28 v18.91,19.55 v18.91,20.82 19.55,21.45 | 12.56,30.34 C3.- 12.56,27.8 16.38,27.8 16.71,27.7 | C4.- 34.79,30.34 | 22.9,5.12 30.17,5.12 30.98,4.31 30.98,2.41
  Top 1.676: PIGGY_PWR.8 PIGGY_PWR.6 PIGGY_PWR.4 PIGGY_PWR.2
  Bottom 0.406: v51.94,11.29 51.94,13.2 44.95,13.2 ICSP.3
  Bottom 0.61: 18.3,3.5 18.3,5.1 | 21.8,8.1 24.6,8.1
  Bottom 1.676: PIGGY_PWR.2 8.12,12.56 15.74,4.95 18.11,4.95 VIN.3
  pour Top: 59.55,32.25 59.55,36.06 55.74,36.06 55.74,32.25
  pour Bottom (isolate 0.61): 0.86,0.86 114.58,0.86 114.8,28.44 107.18,28.44 107.18,48.12 105.91,49.4 10.03,49.4 8.12,47.49 8.12,28.44 0.5,28.44
ICPGC
  Top 0.406: ICSP.5 46.22,18.28 47.49,19.55 53.2,19.55 54.66,21.01 IC2.12
ICPGD
  Top 0.406: IC2.13 55.13,20.21 53.2,18.28 49.4,18.28 48.12,17.01 48.12,14.47 45.59,11.93 ICSP.4
ICRST  (via drill 0.8)
  Top 0.406: IC2.33 66.73,14.91 v65.91,15.74
  Bottom 0.406: v65.91,15.74 42.41,15.74 ICSP.1
IR_INT  (via drill 0.8)
  Top 0.406: IC2.10 59.53,20.84 59.94,20.31 59.91,18.3 v61.08,17.01
  Bottom 0.406: v61.08,17.01 61.84,17.64 97.02,17.64 98.29,16.38 IR.1
LED0
  Top 0.406: IC2.36 74.02,14.61 74.8,13.84 R33.2
LED1
  Top 0.406: IC2.35 71.64,13.81 72.25,13.2 R32.2
N$1
  Top 0.305: 51.73,29.93 IC1.31
  Top 0.406: R25.2 51.73,29.93
N$2
  Top 0.406: IC2.37 76.39,15.41 77.33,14.47 C14.1
N$3
  Top 0.406: IC2.30 64.33,7.18 63.37,6.21 | Q1.1 63.37,6.21 | C15.1 62.95,5.79 63.37,6.21
N$4
  Top 0.406: IC2.31 65.13,6.36 65.27,6.21 66.54,6.21 | 66.54,6.21 Q1.2 | C16.1 65.06,4.73 66.54,6.21
N$5
  Top 0.406: C8.1 R27.1
N$6
  Bottom 0.254: 83.33,21 95.62,21 98.42,18.2 103.62,18.2
N$7
  Bottom 0.254: 96.12,22.8 97.92,21 100.03,21
N$8
  Top 0.406: 17.64,51.3 18.91,51.3
N$9
  Top 0.406: 71.62,22.09 R26.2 | 71.62,22.09 70.98,21.45 70.54,21.01 70.35,21.01 IC2.44 | C7.2 73.53,24 71.62,22.09
N$10
  Top 0.406: LED1.A R32.1
N$11
  Top 0.406: 20.18,51.3 21.45,51.3
N$12
  Top 0.406: 25.27,51.3 26.54,51.3
N$13
  Top 0.406: 27.8,51.3 29.07,51.3
N$14
  Top 0.406: IC3.6 23.36,20.18 23.61,19.93 R27.2 C9.1
N$15
  Top 0.406: 35.42,51.3 36.7,51.3
N$16
  Top 0.406: 37.97,51.3 39.23,51.3
N$17
  Top 0.406: 43.05,51.3 44.31,51.3
N$18
  Top 0.406: LED2.A R33.1
N$19
  Top 0.406: 45.59,51.3 46.85,51.3
N$20
  Top 0.406: 50.03,51.3 51.3,51.3
N$21
  Top 0.406: 52.57,51.3 53.84,51.3
N$22
  Top 0.406: 60.19,51.3 61.46,51.3
N$23
  Top 0.406: 62.73,51.3 64,51.3
N$24
  Top 0.406: 67.81,51.3 69.08,51.3
N$25
  Top 0.406: 70.35,51.3 71.62,51.3
N$26
  Top 0.406: 76.06,51.3 77.33,51.3
N$27
  Top 0.406: 78.61,51.3 79.88,51.3
N$28
  Top 0.406: 86.22,51.3 87.5,51.3
N$29
  Top 0.406: 88.77,51.3 90.03,51.3
N$30
  Top 0.406: 93.84,51.3 95.11,51.3
N$31
  Top 0.406: 96.39,51.3 97.66,51.3
N$32
  Top 0.406: 101.47,51.3 102.73,51.3
N$33
  Bottom 0.254: 92.22,28.59 91.22,29.59 89.83,29.59
N$34
  Bottom 0.254: 86.33,29.59 88.62,29.59
N$35
  Top 0.406: 10.03,51.3 11.29,51.3
N$37
  Top 0.406: IC3.4 13.84,18.91 13.2,18.28 13.2,17.64 13.84,17.01 C11.1
N$38
  Top 0.406: IC3.5 22.09,18.91 22.73,18.28 22.73,17.01 23.36,16.38 31.61,16.38 32.03,16.8 R29.2 R30.1
N$39
  Top 0.406: C6.1 17.01,24.63 16.38,24 IC3.1
O00  (via drill 0.7)
  Top 0.305: 67.81,31.88 IC1.5 | 67.81,31.88 101.47,31.88 101.39,31.95 | v67.81,30.98 67.81,31.88
  Top 0.406: T12.4 105.28,33.52 104,32.25 103.64,31.88 101.47,31.88 | IC2.14 58.15,19.41 v58.67,19.93 | RN6.8 101.39,31.95
  Bottom 0.406: v58.67,19.93 60.19,21.45 60.19,29.07 61.46,30.34 67.17,30.34 v67.81,30.98
O01
  Top 0.254: 102.1,41.77 100.83,41.77 100.59,41.54 RN6.7
  Top 0.305: IC1.6 99.96,32.53
  Top 0.406: RN6.7 100.59,33.16 99.96,32.53 | T12.2 102.73,42.41 102.1,41.77
O02
  Top 0.254: 98.29,41.77 99.56,41.77 99.8,41.54 RN6.6
  Top 0.305: IC1.7 99.22,33.18
  Top 0.406: 99.22,33.18 99.8,33.76 RN6.6 | T11.4 97.66,42.41 98.29,41.77
O03
  Top 0.305: IC1.8 95.11,33.83
  Top 0.406: T11.2 95.11,34.16 95.11,33.83 98.6,33.83 99,34.23 RN6.5
O04
  Top 0.305: IC1.9 84.95,34.48 84.89,34.55 | 88.45,34.48 89.08,35.11
  Top 0.406: 88.77,34.79 89.08,35.11 90.03,36.06 T10.4 | 84.95,34.48 88.45,34.48 | RN5.8 84.89,34.55
O05
  Top 0.254: 86.86,41.77 84.32,41.77 84.08,41.54 RN5.7
  Top 0.305: IC1.10 83.45,35.13
  Top 0.406: T10.2 87.5,42.41 86.86,41.77 | RN5.7 84.08,35.77 83.45,35.13
O06
  Top 0.254: 80.51,41.77 83.05,41.77 83.28,41.54 RN5.6
  Top 0.305: IC1.11 82.77,35.78
  Top 0.406: 82.77,35.78 83.28,36.3 RN5.6 | T9.4 79.88,42.41 80.51,41.77
O07
  Top 0.305: IC1.12 77.33,36.43
  Top 0.406: T9.2 77.33,36.7 77.33,36.43 82.15,36.43 82.48,36.77 RN5.5
O08
  Top 0.305: 70.35,37.33 70.1,37.08 IC1.13 58.99,37.08 58.35,37.72 RN4.1
  Top 0.406: 70.35,37.33 71.62,38.6 T8.4
O09
  Top 0.305: 67.81,37.97 67.58,37.73 IC1.14 59.79,37.73 59.16,38.37 RN4.2
  Top 0.406: 67.81,37.97 69.08,39.23 T8.2
O10
  Top 0.305: 63.37,38.6 63.15,38.38 IC1.15 60.59,38.38 59.95,39.02 RN4.3
  Top 0.406: 63.37,38.6 64,39.23 T7.4
O11
  Top 0.305: T7.2 61.46,39.14 IC1.16 60.76,39.03 RN4.4
  Top 0.406: T7.2
O12
  Top 0.305: T6.4 53.84,39.03 IC1.17 54.55,39.03 RN3.1
  Top 0.406: T6.4
O13
  Top 0.305: 51.94,38.6 52.16,38.38 IC1.18 54.71,38.38 55.34,39.02 RN3.2
  Top 0.406: 51.94,38.6 51.3,39.23 T6.2
O14
  Top 0.305: 48.12,37.97 48.36,37.73 IC1.19 55.51,37.73 56.15,38.37 RN3.3
  Top 0.406: 48.12,37.97 46.85,39.23 T5.4
O15
  Top 0.305: 45.59,37.33 45.84,37.08 IC1.20 56.31,37.08 56.95,37.72 RN3.4
  Top 0.406: 45.59,37.33 44.31,38.6 T5.2
O16
  Top 0.305: 39.23,36.43 IC1.21
  Top 0.406: T4.4 39.23,36.7 39.23,36.43 35.05,36.43 34.09,37.4 RN2.8
O17
  Top 0.254: 36.06,41.77 33.52,41.77 33.28,41.54 RN2.7
  Top 0.305: 33.8,35.78 IC1.22
  Top 0.406: 33.8,35.78 33.28,36.3 RN2.7 | T4.2 36.7,42.41 36.06,41.77
O18
  Top 0.254: 29.71,41.77 32.25,41.77 32.48,41.54 RN2.6
  Top 0.305: 33.12,35.13 IC1.23
  Top 0.406: RN2.6 32.48,35.77 33.12,35.13 | T3.4 29.07,42.41 29.71,41.77
O19
  Top 0.305: IC1.24 31.61,34.48 31.68,34.55
  Top 0.406: T3.2 26.54,36.06 27.49,35.11 28.11,34.48 31.61,34.48 | RN2.5 31.68,34.55
O20
  Top 0.305: 21.78,33.83 IC1.25
  Top 0.406: T2.4 21.45,34.16 21.45,33.83 | 21.78,33.83 21.45,33.83 | 21.45,33.83 17.97,33.83 17.57,34.23 RN1.8
O21
  Top 0.254: 18.28,41.77 17.01,41.77 16.77,41.54 RN1.7
  Top 0.305: 17.35,33.18 IC1.26
  Top 0.406: 17.35,33.18 16.77,33.76 RN1.7 | T2.2 18.91,42.41 18.28,41.77
O22
  Top 0.254: 14.47,41.77 15.74,41.77 15.97,41.54 RN1.6
  Top 0.305: 16.61,32.53 IC1.27
  Top 0.406: RN1.6 15.97,33.16 16.61,32.53 | T1.4 13.84,42.41 14.47,41.77
O23
  Top 0.254: 15.18,31.95 15.11,31.88
  Top 0.305: 15.11,31.88 IC1.28
  Top 0.406: T1.2 11.29,33.52 12.56,32.25 12.94,31.88 15.11,31.88 | RN1.5 15.18,31.95
OUT0.0
  Top 0.406: CON8.1 103.37,58.92 103.37,55.74 104,55.11 T12.6 105.28,51.3
OUT0.1
  Top 0.406: CON8.2 102.1,60.19 102.1,55.74 101.47,55.11 T12.8
OUT0.2
  Top 0.406: CON8.3 100.83,57.65 96.39,53.2 T11.6
OUT1.0
  Top 0.406: T11.8 93.84,54.48 93.21,55.11 CON7.1
OUT1.1
  Top 0.406: T10.6 88.77,53.84 90.67,55.74 CON7.2
OUT1.2
  Top 0.406: T10.8 86.22,53.84 88.13,55.74 CON7.3
OUT2.0
  Top 0.406: T9.6 78.61,53.84 80.51,55.74 CON6.1
OUT2.1
  Top 0.406: T9.8 76.06,53.84 77.97,55.74 CON6.2
OUT2.2
  Top 0.406: T8.6 70.35,52.57 75.43,57.65 CON6.3
OUT3.0
  Top 0.406: T8.8 CON5.1
OUT3.1
  Top 0.406: T7.6 62.73,53.2 65.27,55.74 CON5.2
OUT3.2
  Top 0.406: T7.8 60.19,53.2 62.73,55.74 CON5.3
OUT4.0
  Top 0.406: T6.6 52.57,58.28 55.11,60.83 CON4.1
OUT4.1
  Top 0.406: T6.8 50.03,52.57 51.3,53.84 51.3,58.92 52.57,60.19 CON4.2
OUT4.2
  Top 0.406: T5.6 45.59,53.2 50.03,57.65 CON4.3
OUT5.0
  Top 0.406: T5.8 43.05,54.48 42.41,55.11 CON3.1
OUT5.1
  Top 0.406: T4.6 37.97,53.84 39.87,55.74 CON3.2
OUT5.2
  Top 0.406: T4.8 35.42,53.84 37.33,55.74 CON3.3
OUT6.0
  Top 0.406: T3.6 27.8,52.57 29.71,55.11 CON2.1
OUT6.1
  Top 0.406: T3.8 25.27,52.57 27.17,55.11 CON2.2
OUT6.2
  Top 0.406: CON2.3 24.63,57.65 21.45,54.48 20.18,53.2 T2.6
OUT7.0
  Top 0.406: T2.8 17.64,54.48 17.01,55.11 CON1.1
OUT7.1
  Top 0.406: CON1.2 14.47,55.74 12.56,53.84 12.56,51.94 12.57,51.94 T1.6 13.84,51.3
OUT7.2
  Top 0.406: CON1.3 13.2,60.19 13.2,56.38 10.03,53.2 T1.8
T_BLANK  (via drill 0.7, 0.8)
  Top 0.305: v59.81,30.98 59.81,30.34 60.22,29.93 IC1.2 61.88,29.93 62.51,29.93
  Top 0.406: IC2.32 65.91,11.21 65.91,13.84 64.64,15.11 64.64,18.28 v66.54,20.18 | v65.91,26.54 63.37,29.07 62.73,29.71 62.51,29.93
  Bottom 0.406: PIGGY_SIG.8 55.74,29.71 57.02,30.98 58.92,30.98 v59.81,30.98 | v65.91,26.54 65.91,20.82 v66.54,20.18
T_BOOT  (via drill 0.8)
  Top 0.406: IC2.20 60.05,14.61 v60.19,14.47 | v95.75,14.47 98.29,14.47 | 98.29,14.47 R31.1 | BOOT.1 99.91,20.53 98.29,18.91 98.29,14.47
  Bottom 0.406: v60.19,14.47 v95.75,14.47
T_LATCH  (via drill 0.8)
  Top 0.305: IC1.30 56.02,30.58 v57.65,29.2
  Top 0.406: IC2.11 58.73,24.18 v58.28,24.63
  Bottom 0.406: 58.28,25.27 v58.28,24.63 | 58.28,25.27 58.28,28.69 57.9,29.07 v57.65,29.2 | PIGGY_SIG.6 54.48,25.27 58.28,25.27
T_MISO
  Top 0.305: IC2.8 61.13,24.32 59.55,25.9 57.65,25.9 57.02,25.27 49.4,25.27 PIGGY_SIG.1
T_MISO_LOOP  (via drill 0.8)
  Top 0.305: IC1.29 48.38,31.23 v47.49,30.34
  Bottom 0.406: PIGGY_SIG.2 47.49,27.17 v47.49,30.34
T_MOSI
  Top 0.305: IC1.4 65.02,31.23 65.27,30.98
  Top 0.406: IC2.1 66.73,24.82 67.17,25.27 67.17,29.07 65.27,30.98
T_POWER  (via drill 0.8)
  Top 0.406: T13.2 41.14,25.9 41.77,25.27 41.77,23.36 | 41.77,23.36 T13.4 R28.1 | PIGGY_SIG.5 53.2,23.36 51.94,22.09 v42.41,22.09 41.77,22.73 41.77,23.36 | IC2.15 58.59,18.61 58.92,18.28 v58.92,17.01
  Bottom 0.406: v42.41,22.09 42.41,18.28 43.68,17.01 v58.92,17.01
T_SCK  (via drill 0.8)
  Top 0.305: 63.89,30.58 IC1.3
  Top 0.406: IC2.9 60.33,21.32 61.21,20.31 v61.21,18.91 | v65.27,29.07 65.27,29.2 63.89,30.58
  Bottom 0.406: v65.27,29.07 64.64,28.44 64.64,19.55 64,18.91 v61.21,18.91 60.06,18.91 59.43,18.28 53.84,18.28 53.33,18.79 53.2,18.91 50.66,21.45 PIGGY_SIG.3
USB_D+  (via drill 0.8)
  Top 0.406: IC2.43 86.83,20.21 88.13,18.91 v88.13,16.38 | v85.59,16.38 85.59,13.19 PLUG_USB.D+
  Bottom 0.406: v88.13,16.38 v85.59,16.38
USB_D-
  Top 0.406: PLUG_USB.D- 86.87,15.1 86.86,18.28 85.73,19.41 IC2.42
USB_SENSE
  Top 0.406: PLUG_USB.VUSB 89.37,19.58 88.77,20.18 87.94,21.01 86.86,22.09 76.7,22.09 R26.1
VIN
  Top 2.54: FUSE.1 16.5,13.71 18.28,11.93 VIN.1
(copper drawn outside any net)
  shapes: Bottom circle x2

### Text on the board
Bottom: swobowff | @ | c@rstenpresser.de
tNames: Karate | Light | v06 | USB | c@rstenpresser.de